# Altium schematic sheet Vref_2v5.SchDoc
size A4
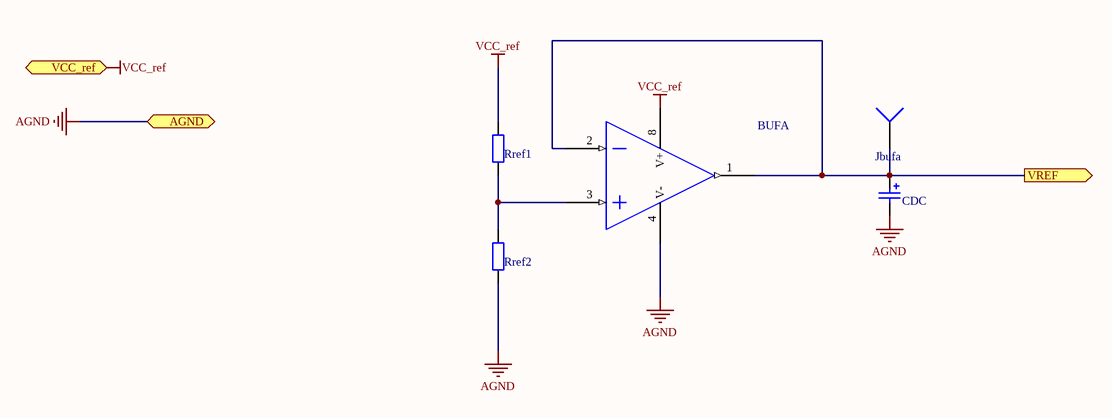
[diagram p0: Vref_2v5.SchDoc]

## Parts
BUF  LT6221  [ECE-SO8]  (value not drawn)  (part A of 2)
CDC  10uF  [ECE-CAPAE4X5.4SM]  (value not drawn)
Jbufa  TEST PIN  [ECE-HDR1TH]  (value not drawn)
Rref1  47K  [ECE-RESC1608-0603SM]  (value not drawn)
Rref2  47K  [ECE-RESC1608-0603SM]  (value not drawn)

## Ports
AGND (bidir), VCC_ref (in), VREF (out)

## Nets
AGND: BUF.4(V-) CDC.2 Rref2.1 ; port AGND
VCC_ref: BUF.8(V+) Rref1.2 ; port VCC_ref
VREF: BUF.1(OUT1) BUF.2(IN1(-)) CDC.1 Jbufa.1 ; port VREF
NetBUF_3: BUF.3(IN1(+)) Rref1.1 Rref2.2

## Library data of the parts
BUF = OPA000102: IC OPAMP LT6221 DUAL SM; Manufactuer: Linear Technology; Manufacturer-PN: LT6221CS8#TRPBF; Assembly Method: Surface Mount; Item Type: Item; Path: ece/ts/Lists/Stock Inventory; UoA Stock#: OPA000102; Value: LT6221; Size/Package: S8; Datasheet Link: http://share.engineering.auckland.ac.nz/ece/ts/Student%20Documents/LT6221.pdf; Supplier1: Arrow; Supplier1-PN: LT6221CS8#TRPBF; Supplier2: Digikey; Supplier2-PN: LT6221CS8#PBF-ND; Component Type: S8-LT6221; Category: OpAmp; Status: Active
CDC = CAP000303: CAP 10uF 16V ELE SM; Manufactuer: Nichicon; Manufacturer-PN: UWT1C100MCL1GB; Assembly Method: Surface Mount; Item Type: Item; Path: ece/ts/Lists/Stock Inventory; Revision: July-2002: Re-released for DXP Platform.; Value: 10uF; UoA Stock#: CAP000303; Size/Package: 4 X 5.4; Voltage/Current: 16V; Datasheet Link: http://share.engineering.auckland.ac.nz/ece/ts/Student%20Documents/SMT-Ecaps-e-wx.pdf; Supplier1: Digikey; Supplier1-PN: 493-2173-2-ND; Component Type: CAP-4X5.4-10uF-16V; Category: Capacitor; Status: Active
Jbufa = CON000017: Value: 1 way; Assembly Method: Through hole; Item Type: Item; Path: ece/ts/Lists/Stock Inventory; UoA Stock#: CON000017; Component Type: NA; Category: Connector; Status: Active
Rref1 Rref2 = RES000158: RES CER 47K 1608 SM; Manufactuer: Yageo; Manufacturer-PN: RC0603FR-0747KL; Assembly Method: Surface Mount; Voltage/Current: 1/10W; Item Type: Item; Path: ece/ts/Lists/Stock Inventory; Value: 47K; UoA Stock#: RES000158; Size/Package: 1608 (0603); Supplier1: Digikey; Supplier1-PN: 311-47.0KHRTR-ND; Component Type: RES-1608-47K; Category: Resistor; Status: Active; Datasheet Link: http://share.engineering.auckland.ac.nz/ece/ts/Student%20Documents/Yageo-Resistors.pdf